# Altium project AD9834系统板.PrjPcb
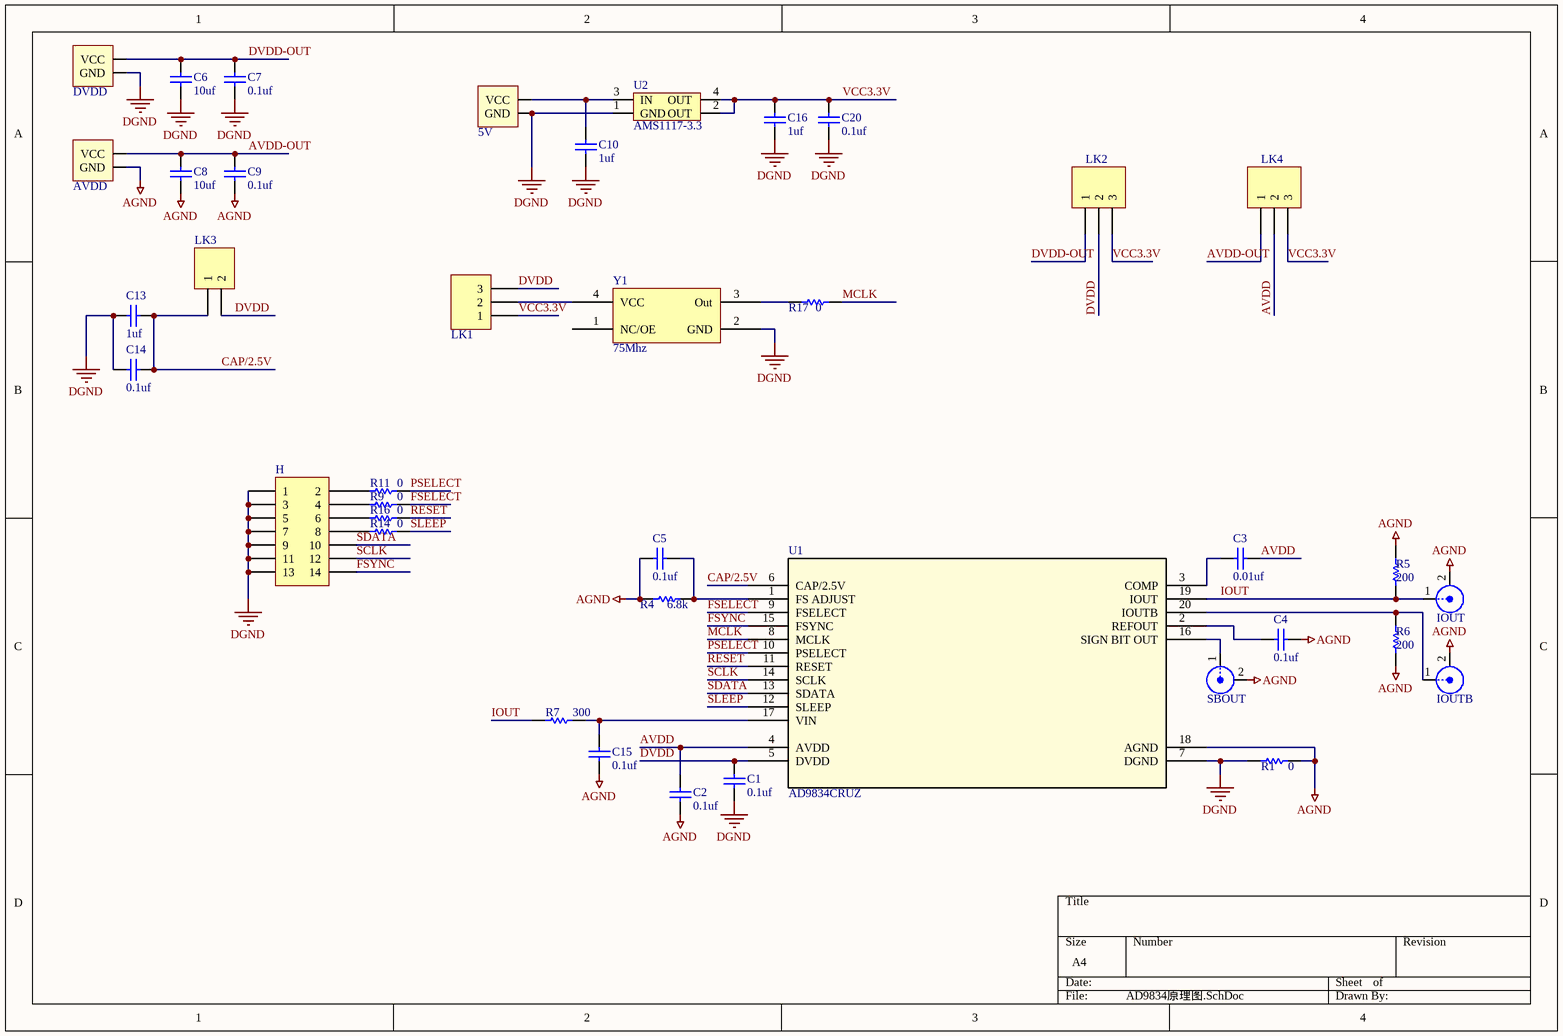
[diagram p0: AD9834原理图.SchDoc]
1 sheet, 39 parts. Net scope: global (net labels, ports and power ports of the same name join across sheets).
Board file: AD9834PCB.PcbDoc

## Sheet AD9834原理图.SchDoc
size A4

### Parts
5V  Power_2Port  [Power_S_2Port]  (value not drawn)
AVDD  Power_2Port  [Power_S_2Port]  (value not drawn)
C1  值: 0.1uf  [0805]  (hidden comment: Cap1)
C2  值: 0.1uf  [0805]  (hidden comment: Cap1)
C3  值: 0.01uf  [0805]  (hidden comment: Cap1)
C4  值: 0.1uf  [0805]  (hidden comment: Cap1)
C5  值: 0.1uf  [0805]  (hidden comment: Cap1)
C6  值: 10uf  [0805]  (hidden comment: Cap1)
C7  值: 0.1uf  [0805]  (hidden comment: Cap1)
C8  值: 10uf  [0805]  (hidden comment: Cap1)
C9  值: 0.1uf  [0805]  (hidden comment: Cap1)
C10  值: 1uf  [0805]  (hidden comment: Cap1)
C13  值: 1uf  [0805]  (hidden comment: Cap1)
C14  值: 0.1uf  [0805]  (hidden comment: Cap1)
C15  值: 0.1uf  [0805]  (hidden comment: Cap1)
C16  值: 1uf  [0805]  (hidden comment: Cap1)
C20  值: 0.1uf  [0805]  (hidden comment: Cap1)
DVDD  Power_2Port  [Power_S_2Port]  (value not drawn)
H  Header 7X2  [IDC-14]  (value not drawn)
IOUT  SMA-2  [SMA-KE]  (value not drawn)
IOUTB  SMA-2  [SMA-KE]  (value not drawn)
LK1  Header 3  [HDR3X1_A]  (value not drawn)
LK2  Header 3  [HDR3X1_A]  (value not drawn)
LK3  Header 2  [HDR2X1_A]  (value not drawn)
LK4  Header 3  [HDR3X1_A]  (value not drawn)
R1  值: 0  [0805]  (hidden comment: RES)
R4  值: 6.8k  [0805]  (hidden comment: RES)
R5  值: 200  [0805]  (hidden comment: RES)
R6  值: 200  [0805]  (hidden comment: RES)
R7  值: 300  [0805]  (hidden comment: RES)
R9  值: 0  [0805]  (hidden comment: RES)
R11  值: 0  [0805]  (hidden comment: RES)
R14  值: 0  [0805]  (hidden comment: RES)
R16  值: 0  [0805]  (hidden comment: RES)
R17  值: 0  [0805]  (hidden comment: RES)
SBOUT  SMA-2  [SMA-KE]  (value not drawn)
U1  AD9834CRUZ  [RU_20]
U2  AMS1117-3.3  [SOT-223]
Y1  75Mhz  [SMDXTAL5032]

### Nets
AGND: AVDD.2(GND) C2.1 C4.2 C5.1 C8.1 C9.1 C15.1 IOUT.2(GND) IOUTB.2(GND) R1.2 R4.1 R5.2 R6.1 SBOUT.2(GND) U1.18(AGND)
DGND: 5V.2(GND) C1.1 C6.1 C7.1 C10.1 C13.1 C14.1 C16.1 C20.1 DVDD.2(GND) H.1 H.3 H.5 H.7 H.9 H.11 H.13 R1.1 U1.7(DGND) U2.1(GND) Y1.2(GND)
AVDD: C2.2 C3.2 LK4.2 U1.4(AVDD)
AVDD-OUT: AVDD.1(VCC) C8.2 C9.2 LK4.1
CAP/2.5V: C13.2 C14.2 LK3.1 U1.6(CAP/2.5V)
DVDD: C1.2 LK1.3 LK2.2 LK3.2 U1.5(DVDD)
DVDD-OUT: C6.2 C7.2 DVDD.1(VCC) LK2.1
FSELECT: R9.2 U1.9(FSELECT)
FSYNC: H.14 U1.15(FSYNC)
IOUT: IOUT.1(Signal) R5.1 R7.1 U1.19(IOUT)
MCLK: R17.2 U1.8(MCLK)
PSELECT: R11.2 U1.10(PSELECT)
RESET: R16.2 U1.11(RESET)
SCLK: H.12 U1.14(SCLK)
SDATA: H.10 U1.13(SDATA)
SLEEP: R14.2 U1.12(SLEEP)
VCC3.3V: C16.2 C20.2 LK1.1 LK2.3 LK4.3 U2.2(OUT) U2.4(OUT)
Net5V_1: 5V.1(VCC) C10.2 U2.3(IN)
NetC3_1: C3.1 U1.3(COMP)
NetC4_1: C4.1 U1.2(REFOUT)
NetC5_2: C5.2 R4.2 U1.1(FS_ADJUST)
NetC15_2: C15.2 R7.2 U1.17(VIN)
NetH_2: H.2 R11.1
NetH_4: H.4 R9.1
NetH_6: H.6 R16.1
NetH_8: H.8 R14.1
NetIOUTB_1: IOUTB.1(Signal) R6.2 U1.20(IOUTB)
NetLK1_2: LK1.2 Y1.4(VCC)
NetR17_1: R17.1 Y1.3(Out)
NetSBOUT_1: SBOUT.1(Signal) U1.16(SIGN_BIT_OUT)

Not connected (* = marked no-connect by the designer): Y1 1(NC/OE)

### Library data of the parts
H = Header 7X2: Header, 7-Pin, Dual row; LatestRevisionDate: 17-Jul-2002; LatestRevisionNote: Re-released for DXP Platform.; Publisher: Altium Limited
LK1 LK2 LK4 = Header 3: 接插件; LatestRevisionDate: 17-Jul-2002; LatestRevisionNote: Re-released for DXP Platform.; Publisher: Altium Limited
LK3 = Header 2: 接插件; LatestRevisionDate: 17-Jul-2002; LatestRevisionNote: Re-released for DXP Platform.; Publisher: Altium Limited
U1 = AD9834CRUZ: Imported; Manufacturer_Part_Number: AD9834CRUZ; Vendor: Vendor; Value: Value; Type: Type; RefDes: Refdes
U2 = AMS1117
Y1 = XTAL4